# Altium schematic sheet 05_iMX 8X_PCIE.SchDoc
size A3; SheetNumber: 6; SheetTotal: 24
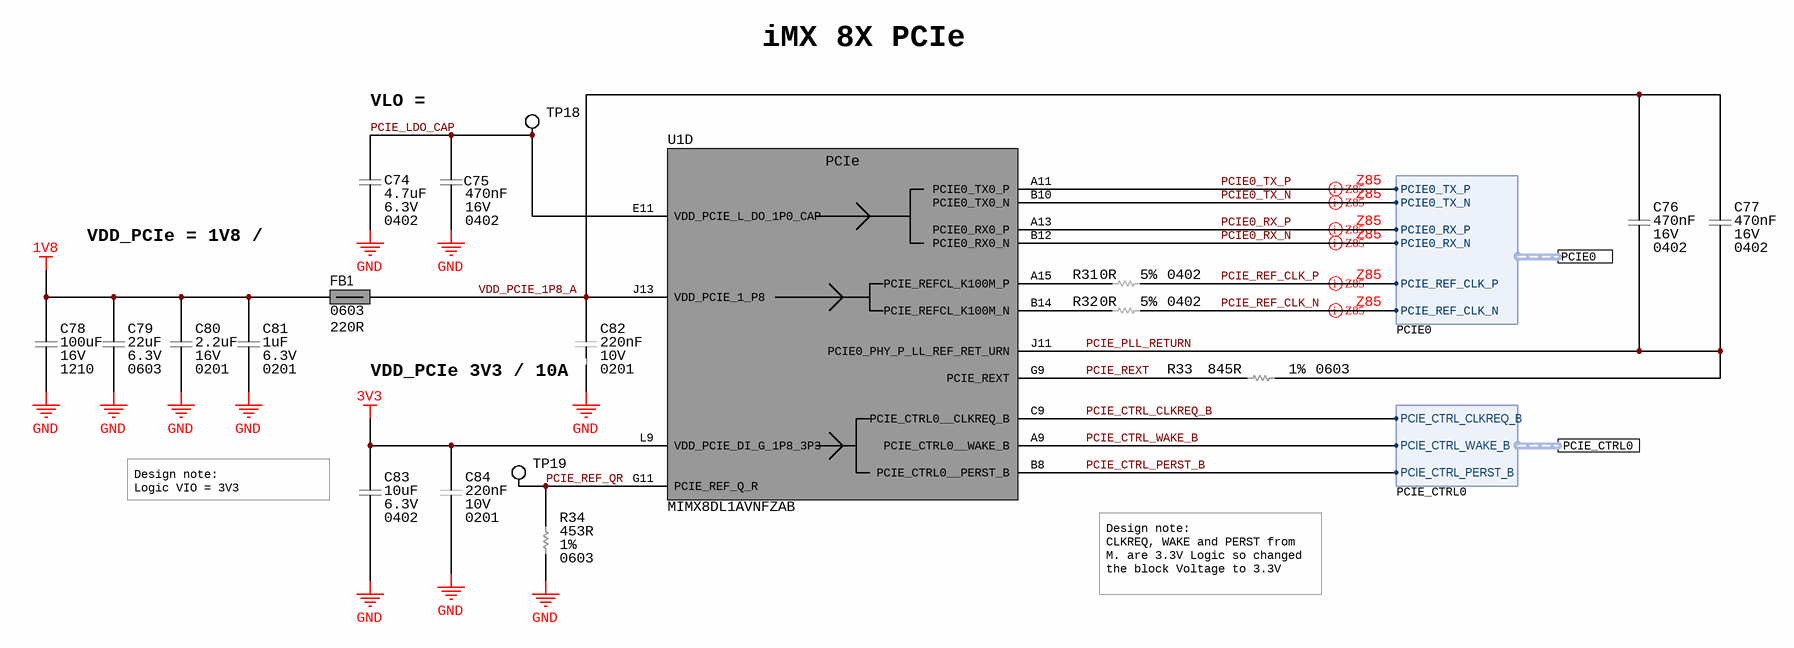
[diagram p0: 05_iMX 8X_PCIE.SchDoc]

## Parts
C74  Capacitance: 4.7uF  Voltage Rating: 6.3V  Case/Package: 0402  [CAP_0402_CAPC1005X05N]  (hidden comment: C1005X5R0J475M050BC)
C75  Voltage Rating: 16V  Capacitance: 470nF  Case/Package: 0402  [CAP_0402_CAPC1005X05N]  (hidden comment: GRT155R61C474KE01D)
C76  Voltage Rating: 16V  Capacitance: 470nF  Case/Package: 0402  [CAP_0402_CAPC1005X05N]  (hidden comment: GRT155R61C474KE01D)
C77  Voltage Rating: 16V  Capacitance: 470nF  Case/Package: 0402  [CAP_0402_CAPC1005X05N]  (hidden comment: GRT155R61C474KE01D)
C78  Voltage Rating: 16V  Capacitance: 100uF  Case/Package: 1210  [CAP_1210_CAPC3225X270N]  (hidden comment: EMK325ABJ107MM-T)
C79  Voltage Rating: 6.3V  Capacitance: 22uF  Case/Package: 0603  [CAP_0603_CAPC1608X08N]  (hidden comment: GRM188R60J226MEA0D)
C80  Capacitance: 2.2uF  Voltage Rating: 16V  Case/Package: 0201  [CAP_0201_CAPC0603X03N]  (hidden comment: GRM035R61C225ME01D)
C81  Voltage Rating (DC): 6.3V  Capacitance: 1uF  Case/Package: 0201  [CAP_0201_CAPC0603X03N]  (hidden comment: 02016D105MAT2A)
C82  Voltage Rating (DC): 10V  Capacitance: 220nF  Case/Package: 0201  [CAP_0201_CAPC0603X03N]  (hidden comment: LMK063BJ224MP-F)
C83  Case/Package: 0402  Capacitance: 10uF  Voltage Rating: 6.3V  [CAP_0402_CAPC1005X05N]  (hidden comment: CL05A106MQ5NUNC)
C84  Voltage Rating (DC): 10V  Capacitance: 220nF  Case/Package: 0201  [CAP_0201_CAPC0603X03N]  (hidden comment: LMK063BJ224MP-F)
FB1  Case/Package: 0603  Impedance: 220R  [IND_0603_INDC1608X08N]  (hidden comment: BLM18SG221TN1D)
R31  Case Code (Imperial): 0402  Tolerance: 5%  Resistance: 0R  [RES_0402_RESC1005X04N]  (hidden comment: ERJ-2GE0R00X)
R32  Case Code (Imperial): 0402  Tolerance: 5%  Resistance: 0R  [RES_0402_RESC1005X04N]  (hidden comment: ERJ-2GE0R00X)
R33  Tolerance: 1%  Resistance: 845R  Case/Package: 0603  [RES_0603_RESC1608X04N]  (hidden comment: RC0603FR-07845RL)
R34  Resistance: 453R  Resistance Tolerance: 1%  Case/Package: 0603  [RES_0603_RESC1608X04N]  (hidden comment: CRCW0603453RFKEA)
TP18  NO COMPONENT  [TP_PAD_0.5MM_SMD_ROUND]  (value not drawn)  (no BOM)
TP19  NO COMPONENT  [TP_PAD_0.5MM_SMD_ROUND]  (value not drawn)  (no BOM)
U1  MIMX8DL1AVNFZAB  [MIMX8DL1AVNFZAB]  (part D of 15)

## Ports
PCIE0 (harness PCIE0), PCIE_CTRL0 (harness PCIE_CTRL0)

## Harnesses
PCIE0: PCIE0_TX_P, PCIE0_TX_N, PCIE0_RX_P, PCIE0_RX_N, PCIE_REF_CLK_P, PCIE_REF_CLK_N
PCIE_CTRL0: PCIE_CTRL_CLKREQ_B, PCIE_CTRL_WAKE_B, PCIE_CTRL_PERST_B

## Nets
1V8: C78.2 C79.2 C80.2 C81.2 FB1.1
3V3: C83.2 C84.2 U1.L9(VDD_PCIE_DI_G_1P8_3P3)
GND: C74.1 C75.1 C78.1 C79.1 C80.1 C81.1 C82.1 C83.1 C84.1 R34.1
PCIE0_RX_N: U1.B12(PCIE0_RX0_N) ; port PCIE0.PCIE0_RX_N
PCIE0_RX_P: U1.A13(PCIE0_RX0_P) ; port PCIE0.PCIE0_RX_P
PCIE0_TX_N: U1.B10(PCIE0_TX0_N) ; port PCIE0.PCIE0_TX_N
PCIE0_TX_P: U1.A11(PCIE0_TX0_P) ; port PCIE0.PCIE0_TX_P
PCIE_CTRL_CLKREQ_B: U1.C9(PCIE_CTRL0__CLKREQ_B) ; port PCIE_CTRL0.PCIE_CTRL_CLKREQ_B
PCIE_CTRL_PERST_B: U1.B8(PCIE_CTRL0__PERST_B) ; port PCIE_CTRL0.PCIE_CTRL_PERST_B
PCIE_CTRL_WAKE_B: U1.A9(PCIE_CTRL0__WAKE_B) ; port PCIE_CTRL0.PCIE_CTRL_WAKE_B
PCIE_LDO_CAP: C74.2 C75.2 TP18.1 U1.E11(VDD_PCIE_L_DO_1P0_CAP)
PCIE_PLL_RETURN: C76.1 C77.1 R33.2 U1.J11(PCIE0_PHY_P_LL_REF_RET_URN)
PCIE_REF_CLK_N: R32.2 ; port PCIE0.PCIE_REF_CLK_N
PCIE_REF_CLK_P: R31.2 ; port PCIE0.PCIE_REF_CLK_P
PCIE_REF_QR: R34.2 TP19.1 U1.G11(PCIE_REF_Q_R)
PCIE_REXT: R33.1 U1.G9(PCIE_REXT)
VDD_PCIE_1P8_A: C76.2 C77.2 C82.2 FB1.2 U1.J13(VDD_PCIE_1_P8)
NetR31_1: R31.1 U1.A15(PCIE_REFCL_K100M_P)
NetR32_1: R32.1 U1.B14(PCIE_REFCL_K100M_N)

## Layout directives
differential pair; net class Z85; differential pair class Z85: PCIE0_RX_N, PCIE0_RX_P, PCIE0_TX_N, PCIE0_TX_P, PCIE_REF_CLK_N, PCIE_REF_CLK_P

## Notes on the sheet
- iMX 8X PCIe
- VLO = 1V
- VDD_PCIe = 1V8 / 2.5A
- (near C82) VDD_PCIe 3V3 / 10A
- (near C83) Design note:
  Logic VIO = 3V3
- Design note:
  CLKREQ, WAKE and PERST from M. are 3.3V Logic so changed the block Voltage to 3.3V
- PCB Des :
- Approv By :
- Project Title :
- Sheet Title :
- Date :
- PCB Version :
- Size :
- A3
- Page :
- PCB Revision :
- (in symbol IC_MPU_ARM_1.2GHz_MIMX8DL1AVNFZAB, part D) PCIe

## Library data of the parts
C74 = CAP_4.7UF_6.3V_X5R_0402: Multilayer Ceramic Capacitor, 4.7 uF, 6.3 V, ± 20%, X5R, 0402 [1005 Metric]; Manufacturer: TDK; Material: 4241ConductorMaterial; Dissipation Factor: 10%; Supplier 1: Digi-Key; Manufacturer Part Number: C1005X5R0J475M050BC; RoHS: Yes; Category: Ceramic Capacitors; Stock 1: 799722; Pricing 1: 1=0.35, 10=0.233, 50=0.1716, 100=0.1396, 500=0.11024, 1000=0.0931, 2500=0.0882, 5000=0.0833 (USD); Mount: Surface Mount; Dielectric Material: Ceramic; Case Code (Metric): 1005; Case Code (Imperial): 0402; Weight: 2.3E-05oz; Min Operating Temperature: -55°C; Max Operating Temperature: 85°C; Packaging: Tape and Reel; Tolerance: 20%; Voltage Rating (DC): 6.3V; Dielectric: X5R; Package Quantity: 1; Termination: SMD/SMT; Voltage: 6.3V; Series: C; Construction: Flat; Length: 1mm; Width: 0.02inch; Height: 0.5mm; Depth: 0.5mm; Thickness: 0.026inch; Lead Free: Lead Free; Reach SVHC Compliant: No; RoHS Compliant: Yes; ComponentLink1URL: https://datasheet.ciiva.com/24216/c1005x5r0j475m050bc-264348-24216583.pdf?src-supplier=Mouser; ComponentLink1Description: https://datasheet.ciiva.com/24216/c1005x5r0j475m050bc-264348-24216583.pdf?src-supplier=Mouser; ComponentLink2URL: https://datasheet.ciiva.com/5962/639999-5962567.pdf?src-supplier=Farnell; ComponentLink2Description: https://datasheet.ciiva.com/5962/639999-5962567.pdf?src-supplier=Farnell; ComponentLink3URL: https://datasheet.ciiva.com/22648/1796654-22648701.pdf?src-supplier=Element14; ComponentLink3Description: https://datasheet.ciiva.com/22648/1796654-22648701.pdf?src-supplier=Element14; ComponentLink4URL: https://datasheet.ciiva.com/22749/1744655-22749711.pdf?src-supplier=Element14; ComponentLink4Description: https://datasheet.ciiva.com/22749/1744655-22749711.pdf?src-supplier=Element14; ComponentLink5URL: https://datasheet.ciiva.com/7770/639999-7770124.pdf?src-supplier=Element14; ComponentLink5Description: https://datasheet.ciiva.com/7770/639999-7770124.pdf?src-supplier=Element14; ComponentLink6URL: https://datasheet.ciiva.com/6289/tdkmlcccaprange-6289886.pdf?src-supplier=Digi-Key; ComponentLink6Description: https://datasheet.ciiva.com/6289/tdkmlcccaprange-6289886.pdf?src-supplier=Digi-Key; ComponentLink7URL: https://datasheet.ciiva.com/6289/tdkmlcccaprange-6289895.pdf?src-supplier=Digi-Key; ComponentLink7Description: https://datasheet.ciiva.com/6289/tdkmlcccaprange-6289895.pdf?src-supplier=Digi-Key; ComponentLink8URL: https://datasheet.ciiva.com/16425/e412-c-16425670.pdf?src-supplier=Future+Electronics; ComponentLink8Description: https://datasheet.ciiva.com/16425/e412-c-16425670.pdf?src-supplier=Future+Electronics; Supplier Part Number 1: 445-7395-1-ND
C75-C77 = CAP_0.47UF_16V_X5R_0402: 0402 0.47 uF 16 V ±10 % Tolerance X5R SMT Multilayer Ceramic Capacitor; Manufacturer: Murata; Tolerance: 10%; Supplier 1: Digi-Key; Manufacturer Part Number: GRT155R61C474KE01D; RoHS: Yes; Category: Ceramic Capacitors; Stock 1: 1892752; Pricing 1: 1=0.4, 10=0.27, 50=0.215, 100=0.1775, 500=0.13868, 1000=0.11788, 2500=0.11095, 5000=0.10401 (USD); Mount: Surface Mount; Case Code (Metric): 1005; Case Code (Imperial): 0402; Min Operating Temperature: -55°C; Max Operating Temperature: 85°C; Packaging: Cut Tape; Series: GRT; Length: 0.039inch; Width: 0.02inch; Thickness: 0.022inch; Ratings: AEC-Q200; RoHS Compliant: Yes; ComponentLink1URL: http://search.murata.co.jp/Ceramy/image/img/A01X/G101/ENG/GRT155R61C474KE01-01.pdf?src-supplier=Digi-Key; ComponentLink1Description: http://search.murata.co.jp/Ceramy/image/img/A01X/G101/ENG/GRT155R61C474KE01-01.pdf?src-supplier=Digi-Key; ComponentLink2URL: https://datasheet.octopart.com/GRT155R61C474KE01D-Murata-datasheet-149523552.pdf?src-supplier=Newark; ComponentLink2Description: https://datasheet.octopart.com/GRT155R61C474KE01D-Murata-datasheet-149523552.pdf?src-supplier=Newark; ComponentLink3URL: https://datasheet.octopart.com/GRT155R61C474KE01D-Murata-datasheet-82944871.pdf?src-supplier=Future+Electronics; ComponentLink3Description: https://datasheet.octopart.com/GRT155R61C474KE01D-Murata-datasheet-82944871.pdf?src-supplier=Future+Electronics; ComponentLink4URL: https://datasheet.octopart.com/GRT155R61C474KE01D-Murata-datasheet-165579666.pdf?src-supplier=TME; ComponentLink4Description: https://datasheet.octopart.com/GRT155R61C474KE01D-Murata-datasheet-165579666.pdf?src-supplier=TME; Supplier Part Number 1: 490-12261-6-ND
C78 = CAP_100UF_16V_X5R_1210: Multilayer Ceramic Capacitor, 100 uF, 16 V, ± 20%, X5R, 1210 [3225 Metric]; Manufacturer: Taiyo Yuden; Material: 4241ConductorMaterial; Supplier 1: Digikey; Manufacturer Part Number: EMK325ABJ107MM-T; RoHS: Yes; Category: Ceramic Capacitors; Stock 1: 503358; Pricing 1: 1=1.73, 10=1.295, 50=1.1816, 100=0.9681 (USD); Mount: Surface Mount; Case Code (Metric): 3225; Case Code (Imperial): 1210; Min Operating Temperature: -55°C; Max Operating Temperature: 85°C; Tolerance: 20%; Packaging: Tape and Reel; Package Quantity: 500; Voltage Rating (DC): 16V; Dielectric: X5R; Termination: SMD/SMT; Series: M; Length: 3.2mm; Width: 2.5mm; Height: 2.5mm; Reach SVHC Compliant: No; RoHS Compliant: Yes; ComponentLink1URL: http://www.farnell.com/datasheets/1497285.pdf?src-supplier=Farnell; ComponentLink1Description: http://www.farnell.com/datasheets/1497285.pdf?src-supplier=Farnell; Supplier Part Number 1: 587-3152-1-ND
C79 = CAP_22uF_6.3V_X5R_0603: Multilayer Ceramic Capacitor, 22 uF, 6.3 V, ï¿½ 20%, X5R, 0603 [1608 Metric]; Manufacturer: Murata; Supplier 1: Digikey; Manufacturer Part Number: GRM188R60J226MEA0D; RoHS: Yes; Category: Ceramic Capacitors; Stock 1: 4736669; Pricing 1: 1=0.2, 10=0.113, 50=0.0794, 100=0.069, 500=0.05144, 1000=0.04599 (USD); Mount: Surface Mount; Number of Pins: 2; Case Code (Metric): 1608; Case Code (Imperial): 0603; Weight: 0.000222oz; Material: Ceramic; Min Operating Temperature: -55°C; Max Operating Temperature: 85°C; Packaging: Tape and Reel; Package Quantity: 1; Series: GRM; Tolerance: 20%; Dielectric: X5R; Termination: SMD/SMT; Voltage Rating (DC): 6.3V; Length: 0.063inch; Width: 0.031inch; Height: 0.8mm; Thickness: 0.039inch; Lead Free: Lead Free; RoHS Compliant: Yes; Reach SVHC Compliant: No; ComponentLink1URL: https://datasheet.ciiva.com/29540/partnumbering-e-01-29540441.pdf?src-supplier=Digikey; ComponentLink1Description: https://datasheet.ciiva.com/29540/partnumbering-e-01-29540441.pdf?src-supplier=Digikey; ComponentLink2URL: https://datasheet.ciiva.com/29540/partnumbering-e-01-29540442.pdf?src-supplier=Digikey; ComponentLink2Description: https://datasheet.ciiva.com/29540/partnumbering-e-01-29540442.pdf?src-supplier=Digikey; ComponentLink3URL: https://datasheet.ciiva.com/29540/partnumbering-e-01-29540443.pdf?src-supplier=Digikey; ComponentLink3Description: https://datasheet.ciiva.com/29540/partnumbering-e-01-29540443.pdf?src-supplier=Digikey; Supplier Part Number 1: 490-7611-1-ND
C80 = CAP_2.2uF_16V_X5R_0201: General Up to 85C Reflow soldering; Manufacturer: Murata; Material: Ceramic; Dielectric: X5R; Tolerance: 20%; Supplier 1: Digikey; Manufacturer Part Number: GRM035R61C225ME01D; RoHS: No; Category: Ceramic Capacitors; Stock 1: 18674; Pricing 1: 1=0.36, 10=0.233, 50=0.1636, 100=0.1321, 500=0.09814, 1000=0.08587, 2500=0.08178, 5000=0.07565 (USD); Min Operating Temperature: -55°C; Max Operating Temperature: 85°C; Voltage Rating (DC): 16V; Length: 600um; Width: 300um; Height: 550um; Thickness: 500um; RoHS Compliant: Yes; ComponentLink1URL: https://datasheet.octopart.com/GRM035R61C225ME01D-Murata-datasheet-165579666.pdf?src-supplier=TME; ComponentLink1Description: https://datasheet.octopart.com/GRM035R61C225ME01D-Murata-datasheet-165579666.pdf?src-supplier=TME; Supplier Part Number 1: 490-GRM035R61C225ME01DCT-ND
C81 = CAP_1UF_6.3V_X5R_0201: 0201 1 uF 6.3 V ±20 % Tolerance X5R Surface Mount Multilayer Ceramic Capacitor; Manufacturer: Kyocera AVX; Tolerance: 20%; Supplier 1: Mouser; Manufacturer Part Number: 02016D105MAT2A; RoHS: Yes; Category: Ceramic Capacitors; Stock 1: 1026413; Pricing 1: 1=0.1, 10=0.028, 50=0.028, 100=0.014, 1000=0.008, 10000=0.006 (USD); Mount: Surface Mount; Number of Pins: 2; Case Code (Metric): 0603; Case Code (Imperial): 0201; Min Operating Temperature: -55°C; Max Operating Temperature: 85°C; Packaging: Cut Tape; Series: -; Voltage Rating: 6.3V; Package Quantity: 1; Length: 0.024inch; Width: 0.012inch; Thickness: 0.013inch; Depth: 0.3mm; Lead Free: Lead Free; RoHS Compliant: Yes; Reach SVHC Compliant: No; ComponentLink1URL: https://datasheet.ciiva.com/6265/cx5r-6265595.pdf?src-supplier=Digi-Key; ComponentLink1Description: https://datasheet.ciiva.com/6265/cx5r-6265595.pdf?src-supplier=Digi-Key; ComponentLink2URL: https://datasheet.ciiva.com/1123/1666675-1123122.pdf?src-supplier=Element14; ComponentLink2Description: https://datasheet.ciiva.com/1123/1666675-1123122.pdf?src-supplier=Element14; ComponentLink3URL: https://datasheet.ciiva.com/14891/cx5r-14891029.pdf?src-supplier=Digi-Key; ComponentLink3Description: https://datasheet.ciiva.com/14891/cx5r-14891029.pdf?src-supplier=Digi-Key; ComponentLink4URL: https://datasheet.ciiva.com/7614/cx5r-7614682.pdf?src-supplier=Digi-Key; ComponentLink4Description: https://datasheet.ciiva.com/7614/cx5r-7614682.pdf?src-supplier=Digi-Key; ComponentLink5URL: https://datasheet.ciiva.com/14891/cx5r-14891030.pdf?src-supplier=Digi-Key; ComponentLink5Description: https://datasheet.ciiva.com/14891/cx5r-14891030.pdf?src-supplier=Digi-Key; Supplier Part Number 1: 581-02016D105MAT2A; Dielectric: X5R
C82 C84 = CAP_0.22UF_10V_X5R_0201: Multilayer Ceramic Capacitors (High dielectric type), 10V, 0.22 uF, ± 20 %, 0201, X5R, RoHS; Manufacturer: Taiyo Yuden; Material: 4241ConductorMaterial; Tolerance: 20%; Supplier 1: Digikey; Manufacturer Part Number: LMK063BJ224MP-F; RoHS: Yes; Category: Ceramic Capacitors; Stock 1: 6053224; Pricing 1: 1=0.12, 10=0.08, 50=0.0478, 100=0.0375, 500=0.02772, 1000=0.02295, 2500=0.02136, 5000=0.01954 (USD); Mount: Surface Mount; Case Code (Metric): 0603; Case Code (Imperial): 0201; Min Operating Temperature: -55°C; Max Operating Temperature: 85°C; Voltage Rating: 10V; Packaging: Tape and Reel; Package Quantity: 15000; Dielectric: X5R; Termination: SMD/SMT; Voltage: 10V; Series: M; Construction: Flat; Length: 0.6mm; Width: 0.3mm; Height: 0.3mm; Depth: 0.3mm; Radiation Hardening: No; Halogen Free: Halogen Free; RoHS Compliant: Yes; Reach SVHC Compliant: Unknown; ComponentLink1URL: https://datasheet.ciiva.com/134/lmk063bj224mp-f-ss-134995.pdf?src-supplier=Digikey; ComponentLink1Description: https://datasheet.ciiva.com/134/lmk063bj224mp-f-ss-134995.pdf?src-supplier=Digikey; ComponentLink2URL: https://datasheet.ciiva.com/11464/lmk063bj224mp-f-ss-11464053.pdf?src-supplier=Avnet; ComponentLink2Description: https://datasheet.ciiva.com/11464/lmk063bj224mp-f-ss-11464053.pdf?src-supplier=Avnet; ComponentLink3URL: https://datasheet.ciiva.com/15921/1589lmk063bj224mp-f-15921250.pdf?src-supplier=Onlinecomponents.com; ComponentLink3Description: https://datasheet.ciiva.com/15921/1589lmk063bj224mp-f-15921250.pdf?src-supplier=Onlinecomponents.com; ComponentLink4URL: https://datasheet.ciiva.com/26872/getdatasheetpartid-639019-26872592.pdf?src-supplier=Verical; ComponentLink4Description: https://datasheet.ciiva.com/26872/getdatasheetpartid-639019-26872592.pdf?src-supplier=Verical; ComponentLink5URL: https://datasheet.ciiva.com/30243/100lmk063bj224mp-f-30243150.pdf?src-supplier=Onlinecomponents.com; ComponentLink5Description: https://datasheet.ciiva.com/30243/100lmk063bj224mp-f-30243150.pdf?src-supplier=Onlinecomponents.com; ComponentLink6URL: https://datasheet.ciiva.com/28645/746258-28645141.pdf?src-supplier=Element14; ComponentLink6Description: https://datasheet.ciiva.com/28645/746258-28645141.pdf?src-supplier=Element14; ComponentLink7URL: https://datasheet.ciiva.com/5422/mlcc-all-e-541559-5422365.pdf?src-supplier=Mouser; ComponentLink7Description: https://datasheet.ciiva.com/5422/mlcc-all-e-541559-5422365.pdf?src-supplier=Mouser; Supplier Part Number 1: 587-2483-1-ND
C83 = CAP_10UF_6.3V_X5R_0402: Cap Ceramic 10uF 6.3V X5R 20% SMD 0402 85C T/R; Manufacturer: Samsung; Supplier 1: Digikey; Manufacturer Part Number: CL05A106MQ5NUNC; RoHS: Yes; Category: Ceramic Capacitors; Stock 1: 6097180; Pricing 1: 1=0.24, 10=0.153, 50=0.0968, 100=0.0774, 500=0.05588, 1000=0.04943, 2500=0.04728, 5000=0.04299 (USD); Mount: Surface Mount; Case Code (Metric): 1005; Case Code (Imperial): 0402; Min Operating Temperature: -55°C; Max Operating Temperature: 85°C; Packaging: Tape and Reel; Tolerance: 20%; Dielectric: X5R; Series: CL; Package Quantity: 1; Construction: Flat; Length: 1mm; Width: 0.02inch; Height: 0.5mm; Depth: 0.5mm; Thickness: 0.028inch; Radiation Hardening: No; RoHS Compliant: Yes; ComponentLink1URL: https://datasheet.ciiva.com/16437/cl05a106mq5nunc-16437356.pdf?src-supplier=Future+Electronics; ComponentLink1Description: https://datasheet.ciiva.com/16437/cl05a106mq5nunc-16437356.pdf?src-supplier=Future+Electronics; ComponentLink2URL: https://datasheet.ciiva.com/26877/getdatasheetpartid-355289-26877841.pdf?src-supplier=Verical; ComponentLink2Description: https://datasheet.ciiva.com/26877/getdatasheetpartid-355289-26877841.pdf?src-supplier=Verical; Supplier Part Number 1: 1276-1451-1-ND
FB1 = IND_FERRITE_BEADS_220R_2.5A_BLM18SG221TN1D: Ferrite Beads Multi-Layer 220Ohm 25% 100MHz 2.5A 40mOhm DCR 0603 Paper T/R; Manufacturer: Murata; Material: Steel,Ferrite; Number of Lines: 1; DC Resistance (DCR): 40mR; Supplier 1: Mouser; Manufacturer Part Number: BLM18SG221TN1D; RoHS: Yes; Category: Ferrite Beads and Chips; Stock 1: 399917; Pricing 1: 1=0.14, 10=0.071, 50=0.071, 100=0.049, 1000=0.041, 10000=0.032 (USD); Number of Pins: 2; Core Material: Ferrite; Case Code (Metric): 1608; Case Code (Imperial): 0603; Weight: 7.1E-05oz; Min Operating Temperature: -55°C; Max Operating Temperature: 125°C; Package Quantity: 1; Tolerance: 25%; Packaging: Tape and Reel; Current Rating: 2.5A; Termination: SMD/SMT; Max DC Current: 2.5A; Test Frequency: 100MHz; DC Current: 2.5A; Number of Circuits: 1; Series: BLM18S; DC Resistance-Max: 40mR; RMS Current (Irms): 2.5A; Series Resistance: 40mR; Length: 1.6mm; Width: 0.8mm; Height: 0.8mm; Depth: 0.95mm; Radiation Hardening: No; Reach SVHC Compliant: No; Lead Free: Lead Free; RoHS Compliant: Yes; ComponentLink1URL: https://datasheet.ciiva.com/1561/c31e-1561456.pdf?src-supplier=Newark; ComponentLink1Description: https://datasheet.ciiva.com/1561/c31e-1561456.pdf?src-supplier=Newark; ComponentLink2URL: https://datasheet.ciiva.com/41449/001171724-da-01-en-chip-drossel0603-220r-2500ma-1-6x0-8mm-41449352.pdf?src-supplier=Conrad; ComponentLink2Description: https://datasheet.ciiva.com/41449/001171724-da-01-en-chip-drossel0603-220r-2500ma-1-6x0-8mm-41449352.pdf?src-supplier=Conrad; ComponentLink3URL: https://datasheet.ciiva.com/41449/001172313-da-01-en-drossel-0603-220r-21-6x0-8mm-10000st-41449677.pdf?src-supplier=Conrad; ComponentLink3Description: https://datasheet.ciiva.com/41449/001172313-da-01-en-drossel-0603-220r-21-6x0-8mm-10000st-41449677.pdf?src-supplier=Conrad; ComponentLink4URL: https://datasheet.ciiva.com/1012/l0110s0100blm18s-1012626.pdf?src-supplier=Digikey; ComponentLink4Description: https://datasheet.ciiva.com/1012/l0110s0100blm18s-1012626.pdf?src-supplier=Digikey; ComponentLink5URL: https://datasheet.ciiva.com/1012/l0110s0100blm18s-1012627.pdf?src-supplier=Digikey; ComponentLink5Description: https://datasheet.ciiva.com/1012/l0110s0100blm18s-1012627.pdf?src-supplier=Digikey; ComponentLink6URL: https://datasheet.ciiva.com/1012/l0110s0100blm18s-1012628.pdf?src-supplier=Digikey; ComponentLink6Description: https://datasheet.ciiva.com/1012/l0110s0100blm18s-1012628.pdf?src-supplier=Digikey; ComponentLink7URL: https://datasheet.ciiva.com/8508/l0110s0100blm18s-8508310.pdf?src-supplier=Avnet; ComponentLink7Description: https://datasheet.ciiva.com/8508/l0110s0100blm18s-8508310.pdf?src-supplier=Avnet; ComponentLink8URL: https://datasheet.ciiva.com/8021/5151-8021517.pdf?src-supplier=Element14; ComponentLink8Description: https://datasheet.ciiva.com/8021/5151-8021517.pdf?src-supplier=Element14; ComponentLink9URL: https://datasheet.ciiva.com/8021/5151-8021519.pdf?src-supplier=Element14; ComponentLink9Description: https://datasheet.ciiva.com/8021/5151-8021519.pdf?src-supplier=Element14; ComponentLink10URL: https://datasheet.ciiva.com/14122/blm-series-eng-tds-14122910.pdf?src-supplier=Distrelec; ComponentLink10Description: https://datasheet.ciiva.com/14122/blm-series-eng-tds-14122910.pdf?src-supplier=Distrelec; ComponentLink11URL: https://datasheet.ciiva.com/16204/l0110s0100blm18s-16204029.pdf?src-supplier=Future+Electronics; ComponentLink11Description: https://datasheet.ciiva.com/16204/l0110s0100blm18s-16204029.pdf?src-supplier=Future+Electronics; Supplier Part Number 1: 81-BLM18SG221TN1D; Max Current Rating: 2.5A
R31 R32 = RES_0R_5%_100mW_0402: SMD Chip Resistor, Jumper, 0 ohm, 100 mW, 0402 [1005 Metric], Thick Film, General Purpose; Manufacturer: Panasonic; Power Rating: 100mW; Voltage Rating: 50V; Temperature Coefficient: 600ppm/°C; Supplier 1: Mouser; Manufacturer Part Number: ERJ-2GE0R00X; RoHS: Yes; Category: Chip SMD Resistors; Stock 1: 10989354; Pricing 1: 1=0.1, 10=0.013, 50=0.013, 100=0.006, 1000=0.004, 2500=0.003, 10000=0.003 (USD); Mount: Surface Mount; Case/Package: 0402; Contact Plating: Tin; Case Code (Metric): 1005; Size Code: 0402; Min Operating Temperature: -55°C; Max Operating Temperature: 155°C; Resistor Type: Thick Film; Packaging: Cut Tape; Package Quantity: 10000; Number of Terminations: 2; Termination: SMD/SMT; Max Power Dissipation: 100mW; Voltage Rating (DC): 50V; Features: Automotive AEC-Q200; Series: ERJ; Construction: Rectangular; Technology: THICK FILM; Length: 1mm; Width: 0.5mm; Height: 0.35mm; Depth: 0.5mm; Ratings: AEC-Q200; Radiation Hardening: No; Reach SVHC Compliant: No; Military Standard: Not; Lead Free: Lead Free; RoHS Compliant: Yes; ComponentLink1URL: https://datasheet.ciiva.com/11821/0900766b80f806dd-11821176.pdf?src-supplier=Rs; ComponentLink1Description: https://datasheet.ciiva.com/11821/0900766b80f806dd-11821176.pdf?src-supplier=Rs; ComponentLink2URL: https://datasheet.ciiva.com/43460/1678796-43460347.pdf?src-supplier=Farnell; ComponentLink2Description: https://datasheet.ciiva.com/43460/1678796-43460347.pdf?src-supplier=Farnell; ComponentLink3URL: https://datasheet.ciiva.com/46389/1678796-46389518.pdf?src-supplier=Element14; ComponentLink3Description: https://datasheet.ciiva.com/46389/1678796-46389518.pdf?src-supplier=Element14; ComponentLink4URL: https://datasheet.ciiva.com/5959/1678796-5959692.pdf?src-supplier=Farnell; ComponentLink4Description: https://datasheet.ciiva.com/5959/1678796-5959692.pdf?src-supplier=Farnell; ComponentLink5URL: https://datasheet.ciiva.com/28695/1678796-28695758.pdf?src-supplier=Element14; ComponentLink5Description: https://datasheet.ciiva.com/28695/1678796-28695758.pdf?src-supplier=Element14; ComponentLink6URL: https://datasheet.ciiva.com/16783/70260739-16783734.pdf?src-supplier=Allied+Electronics; ComponentLink6Description: https://datasheet.ciiva.com/16783/70260739-16783734.pdf?src-supplier=Allied+Electronics; ComponentLink7URL: https://datasheet.ciiva.com/16778/70260739-16778335.pdf?src-supplier=Allied+Electronics; ComponentLink7Description: https://datasheet.ciiva.com/16778/70260739-16778335.pdf?src-supplier=Allied+Electronics; ComponentLink8URL: https://datasheet.ciiva.com/48531/aoa0000ce1-48531077.pdf?src-supplier=Avnet; ComponentLink8Description: https://datasheet.ciiva.com/48531/aoa0000ce1-48531077.pdf?src-supplier=Avnet; ComponentLink9URL: https://datasheet.ciiva.com/30097/4aoa0000ce1-30097116.pdf?src-supplier=Onlinecomponents.com; ComponentLink9Description: https://datasheet.ciiva.com/30097/4aoa0000ce1-30097116.pdf?src-supplier=Onlinecomponents.com; Supplier Part Number 1: 667-ERJ-2GE0R00X
R33 = RES_845R_1%_100mW_0603: SMD Chip Resistor, 845 Ohm, ± 1%, 100 mW, 0603 [1608 Metric], Thick Film, General Purpose; Manufacturer: Yageo; Power Rating: 100mW; Voltage Rating: 75V; Temperature Coefficient: 100ppm/°C; Voltage Rating (DC): 50V; Supplier 1: Digikey; Manufacturer Part Number: RC0603FR-07845RL; RoHS: Yes; Category: Chip SMD Resistors; Stock 1: 266557; Pricing 1: 1=0.1, 10=0.009, 100=0.0061, 1000=0.00461 (USD); Case Code (Imperial): 0603; Case Code (Metric): 1608; Weight: 7.1E-05oz; Size Code: 0603; Min Operating Temperature: -55°C; Max Operating Temperature: 155°C; Packaging: Tape and Reel; Termination: SMD/SMT; Features: Moisture Resistant; Series: RC; Max Power Dissipation: 100mW; Number of Terminations: 2; Length: 1.6mm; Width: 0.8mm; Height: 0.45mm; Lead Free: Lead Free; RoHS Compliant: Yes; ComponentLink1URL: http://www.mouser.com/ds/2/447/RC0603-272842.pdf?src-supplier=Mouser; ComponentLink1Description: http://www.mouser.com/ds/2/447/RC0603-272842.pdf?src-supplier=Mouser; ComponentLink2URL: http://www.yageo.com/documents/recent/PYu-RC_Group_51_RoHS_L_9.pdf?src-supplier=Digikey; ComponentLink2Description: http://www.yageo.com/documents/recent/PYu-RC_Group_51_RoHS_L_9.pdf?src-supplier=Digikey; ComponentLink3URL: http://www.yageo.com/documents/recent/PYu-RC_Group_51_RoHS_L_10.pdf?src-supplier=Digikey; ComponentLink3Description: http://www.yageo.com/documents/recent/PYu-RC_Group_51_RoHS_L_10.pdf?src-supplier=Digikey; ComponentLink4URL: http://www.yageo.com/documents/recent/PYu-RC0603_51_RoHS_L_7.pdf?src-supplier=Future+Electronics; ComponentLink4Description: http://www.yageo.com/documents/recent/PYu-RC0603_51_RoHS_L_7.pdf?src-supplier=Future+Electronics; ComponentLink5URL: https://datasheet.octopart.com/RC0603FR-07845RL-Yageo-datasheet-164759695.pdf?src-supplier=Future+Electronics; ComponentLink5Description: https://datasheet.octopart.com/RC0603FR-07845RL-Yageo-datasheet-164759695.pdf?src-supplier=Future+Electronics; Supplier Part Number 1: 311-845HRCT-ND
R34 = RES_453R_1%_100mW_0603: Res Thick Film 0603 453 Ohm 1% 0.1W(1/10W) ±100ppm/C Pad SMD T/R Automotive AEC-Q200; Manufacturer: Vishay; Temperature Coefficient: 100ppm/°C; Max Power Dissipation: 100mW; Voltage Rating: 75V; Supplier 1: Mouser; Manufacturer Part Number: CRCW0603453RFKEA; RoHS: Yes; Category: Chip SMD Resistors; Stock 1: 38146; Pricing 1: 1=0.1, 10=0.023, 50=0.023, 100=0.014, 1000=0.011, 10000=0.005 (USD); Number of Pins: 2; Weight: 7.1E-05oz; Case Code (Metric): 1608; Case Code (Imperial): 0603; Contact Plating: Tin; Min Operating Temperature: -55°C; Max Operating Temperature: 155°C; Tolerance: 1%; Packaging: Tape and Reel; Package Quantity: 5000; Number of Terminations: 2; Features: Automotive AEC-Q200; Series: CRCW; Power Rating: 100mW; Resistor Type: Thick Film; Termination: SMD/SMT; Working Voltage: 75V; Construction: Rectangular; Technology: THICK FILM; Length: 1.55mm; Width: 0.033inch; Height: 0.02inch; Depth: 0.85mm; Radiation Hardening: No; RoHS Compliant: Yes; Lead Free: 5697LeadFree; Military Standard: Not; Reach SVHC Compliant: Unknown; ComponentLink1URL: https://datasheet.ciiva.com/2466/dcrcwe3-2466197.pdf?src-supplier=Digikey; ComponentLink1Description: https://datasheet.ciiva.com/2466/dcrcwe3-2466197.pdf?src-supplier=Digikey; ComponentLink2URL: https://datasheet.ciiva.com/3257/dcrcwe3-3257607.pdf?src-supplier=Avnet; ComponentLink2Description: https://datasheet.ciiva.com/3257/dcrcwe3-3257607.pdf?src-supplier=Avnet; ComponentLink3URL: https://datasheet.ciiva.com/3257/dcrcwe3-3257608.pdf?src-supplier=Avnet; ComponentLink3Description: https://datasheet.ciiva.com/3257/dcrcwe3-3257608.pdf?src-supplier=Avnet; ComponentLink4URL: https://datasheet.ciiva.com/5540/dcrcwe3-109170-5540857.pdf?src-supplier=Mouser; ComponentLink4Description: https://datasheet.ciiva.com/5540/dcrcwe3-109170-5540857.pdf?src-supplier=Mouser; ComponentLink5URL: https://datasheet.ciiva.com/16202/dcrcwe3-16202527.pdf?src-supplier=Future+Electronics; ComponentLink5Description: https://datasheet.ciiva.com/16202/dcrcwe3-16202527.pdf?src-supplier=Future+Electronics; Supplier Part Number 1: 71-CRCW0603-453-E3
TP18 TP19 = TP_PAD_SMD_SMALL: Test Point, SMD pad, round, 1.5mm, 1.6mm, 3mm diameter
U1 = IC_MPU_ARM_1.2GHz_MIMX8DL1AVNFZAB: I.MX8 Dxl 15SQ / Tray Rohs Compliant: Yes; Manufacturer: NXP Semiconductors; Supplier 1: Mouser; Manufacturer Part Number: MIMX8DL1AVNFZAB; RoHS: No; Category: Uncategorized; Stock 1: 196; Pricing 1: 1=46.19, 10=40.26, 25=38.57, 50=38.56, 100=33.3, 252=33.16, 1000=33.3, 10000=33.3 (USD); Supplier Part Number 1: 771-MIMX8DL1AVNFZAB